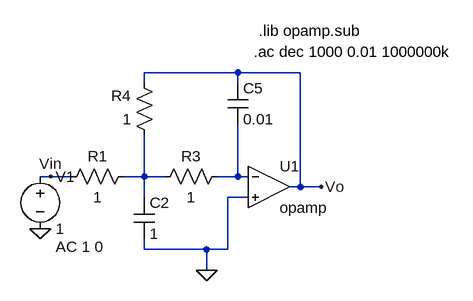
[diagram p0: schematic EJ6.asc]
EJ6.asc, the LTspice schematic file:
Version 4
SHEET 1 880 680
WIRE 208 -32 64 -32
WIRE 304 -32 208 -32
WIRE 64 -16 64 -32
WIRE 208 -16 208 -32
WIRE -80 128 -96 128
WIRE -48 128 -80 128
WIRE 64 128 64 64
WIRE 64 128 32 128
WIRE 96 128 64 128
WIRE 208 128 208 48
WIRE 208 128 176 128
WIRE 224 128 208 128
WIRE 304 144 304 -32
WIRE 304 144 288 144
WIRE 336 144 304 144
WIRE 64 160 64 128
WIRE 224 160 192 160
WIRE 64 240 64 224
WIRE 160 240 64 240
WIRE 192 240 192 160
WIRE 192 240 160 240
WIRE 160 272 160 240
FLAG -96 208 0
FLAG 160 272 0
FLAG 336 144 Vo
FLAG -80 128 Vin
SYMBOL OpAmps\\opamp 256 80 R0
SYMATTR InstName U1
SYMBOL res 48 112 R90
WINDOW 0 0 56 VBottom 2
WINDOW 3 32 56 VTop 2
SYMATTR InstName R1
SYMATTR Value 1
SYMBOL res 192 112 R90
WINDOW 0 0 56 VBottom 2
WINDOW 3 32 56 VTop 2
SYMATTR InstName R3
SYMATTR Value 1
SYMBOL res 80 80 R180
WINDOW 0 36 76 Left 2
WINDOW 3 36 40 Left 2
SYMATTR InstName R4
SYMATTR Value 1
SYMBOL cap 192 -16 R0
SYMATTR InstName C5
SYMATTR Value 0.01
SYMBOL cap 48 160 R0
SYMATTR InstName C2
SYMATTR Value 1
SYMBOL voltage -96 112 R0
WINDOW 123 24 124 Left 2
WINDOW 39 0 0 Left 0
SYMATTR InstName V1
SYMATTR Value 1
SYMATTR Value2 AC 1 0
TEXT 240 -96 Left 2 !.lib opamp.sub
TEXT 232 -64 Left 2 !.ac dec 1000 0.01 1000000k

The netlist it stands for:
* EJ6.asc
XU1 N002 0 Vo opamp Aol=100K GBW=10Meg  ; pins invin noninvin out
R1 N001 Vin 1
R3 N002 N001 1
R4 N001 Vo 1
C5 Vo N002 0.01
C2 N001 0 1
V1 Vin 0 1 AC 1 0
.lib opamp.sub
.ac dec 1000 0.01 1000000k
.backanno
.end